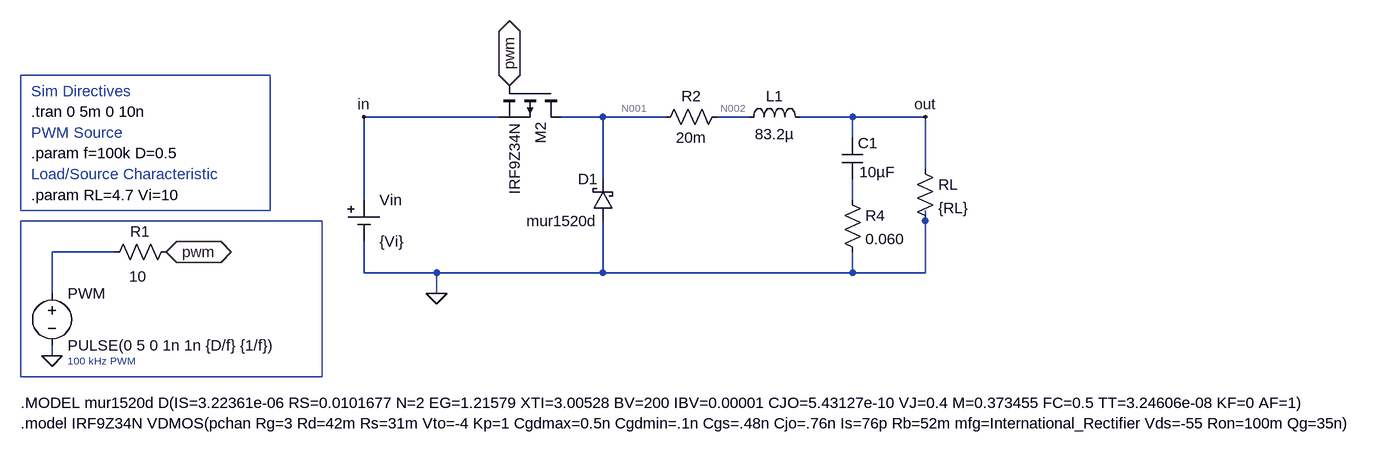
[diagram p0: schematic Buck.asc]
Buck.asc, the LTspice schematic file:
Version 4
SHEET 1 1624 680
WIRE 96 32 -112 32
WIRE 256 32 192 32
WIRE 352 32 256 32
WIRE 480 32 432 32
WIRE 640 32 560 32
WIRE 752 32 640 32
WIRE 640 64 640 32
WIRE 752 112 752 32
WIRE 256 128 256 32
WIRE -112 160 -112 32
WIRE 640 160 640 128
WIRE 752 192 752 176
WIRE -496 240 -592 240
WIRE -112 272 -112 224
WIRE 0 272 -112 272
WIRE 256 272 256 192
WIRE 256 272 0 272
WIRE 640 272 640 240
WIRE 640 272 256 272
WIRE 752 272 752 192
WIRE 752 272 640 272
WIRE -592 304 -592 240
WIRE 0 304 0 272
WIRE -592 400 -592 384
FLAG 0 304 0
FLAG -592 400 0
FLAG -416 240 pwm
IOPIN -416 240 BiDir
FLAG -112 32 in
FLAG 752 32 out
FLAG 112 -16 pwm
IOPIN 112 -16 BiDir
SYMBOL Misc\\cell -112 160 R0
SYMATTR InstName Vin
SYMATTR Value {Vi}
SYMBOL cap 624 64 R0
WINDOW 3 27 53 Left 2
SYMATTR Value 10µF
SYMATTR InstName C1
SYMBOL voltage -592 288 R0
WINDOW 123 0 0 Left 0
WINDOW 39 0 0 Left 0
SYMATTR InstName PWM
SYMATTR Value PULSE(0 5 0 1n 1n {D/f} {1/f})
SYMBOL schottky 272 192 R180
WINDOW 0 24 64 Left 2
WINDOW 3 24 0 Left 2
SYMATTR InstName D1
SYMATTR Value mur1520d
SYMATTR Description Diode
SYMATTR Type diode
SYMBOL res -400 224 R90
WINDOW 0 0 56 VBottom 2
WINDOW 3 38 60 VTop 2
SYMATTR InstName R1
SYMATTR Value 10
SYMBOL res 736 96 R0
SYMATTR InstName RL
SYMATTR Value {RL}
SYMBOL res 624 144 R0
SYMATTR InstName R4
SYMATTR Value 0.060
SYMBOL pmos 192 -16 R90
SYMATTR InstName M2
SYMATTR Value IRF9Z34N
SYMBOL ind 464 48 R270
WINDOW 0 32 56 VTop 2
WINDOW 3 5 56 VBottom 2
SYMATTR InstName L1
SYMATTR Value 83.2µ
SYMBOL res 448 16 R90
WINDOW 0 0 56 VBottom 2
WINDOW 3 32 56 VTop 2
SYMATTR InstName R2
SYMATTR Value 20m
TEXT -568 408 Left 1 ;100 kHz PWM
TEXT -624 24 Left 2 !.tran 0 5m 0 10n
TEXT -624 88 Left 2 !.param f=100k D=0.5
TEXT -624 -8 Left 2 ;Sim Directives
TEXT -624 56 Left 2 ;PWM Source
TEXT -624 152 Left 2 !.param RL=4.7 Vi=10
TEXT -624 120 Left 2 ;Load/Source Characteristic
TEXT -640 472 Left 2 !.MODEL mur1520d D(IS=3.22361e-06 RS=0.0101677 N=2 EG=1.21579 XTI=3.00528 BV=200 IBV=0.00001 CJO=5.43127e-10 VJ=0.4 M=0.373455 FC=0.5 TT=3.24606e-08 KF=0 AF=1)
TEXT -640 504 Left 2 !.model IRF9Z34N VDMOS(pchan Rg=3 Rd=42m Rs=31m Vto=-4 Kp=1 Cgdmax=0.5n Cgdmin=.1n Cgs=.48n Cjo=.76n Is=76p Rb=52m mfg=International_Rectifier Vds=-55 Ron=100m Qg=35n)
RECTANGLE Normal -256 176 -640 -32
RECTANGLE Normal -176 432 -640 192

The netlist it stands for:
* Buck.asc
Vin in 0 {Vi}
C1 out N003 10µF
V§PWM N004 0 PULSE(0 5 0 1n 1n {D/f} {1/f})
D1 0 N001 mur1520d
R1 pwm N004 10
RL out 0 {RL}
R4 N003 0 0.060
M2 N001 pwm in in IRF9Z34N
L1 N002 out 83.2µ
R2 N002 N001 20m
.model D D
.lib standard.dio
.model NMOS NMOS
.model PMOS PMOS
.lib standard.mos
* 100 kHz PWM
.tran 0 5m 0 10n
.param f=100k D=0.5
* Sim Directives
* PWM Source
.param RL=4.7 Vi=10
* Load/Source Characteristic
.MODEL mur1520d D(IS=3.22361e-06 RS=0.0101677 N=2 EG=1.21579 XTI=3.00528 BV=200 IBV=0.00001 CJO=5.43127e-10 VJ=0.4 M=0.373455 FC=0.5 TT=3.24606e-08 KF=0 AF=1)
.model IRF9Z34N VDMOS(pchan Rg=3 Rd=42m Rs=31m Vto=-4 Kp=1 Cgdmax=0.5n Cgdmin=.1n Cgs=.48n Cjo=.76n Is=76p Rb=52m mfg=International_Rectifier Vds=-55 Ron=100m Qg=35n)
.backanno
.end

* Results of the author's LTspice run, read from the files saved beside the schematic
* Operating Point, zero values left out:
*   V(in) = 10 V
*   V(out) = 9.461 V
*   V(n001) = 9.504 V
*   V(n002) = 9.463 V
*   Id(M2) = -2.013 A
*   Is(M2) = 2.013 A
*   I(D1) = -3.224 µA
*   I(L1) = 2.013 A
*   I(R2) = -2.013 A
*   I(Rl) = 2.013 A
*   I(Vin) = -2.013 A